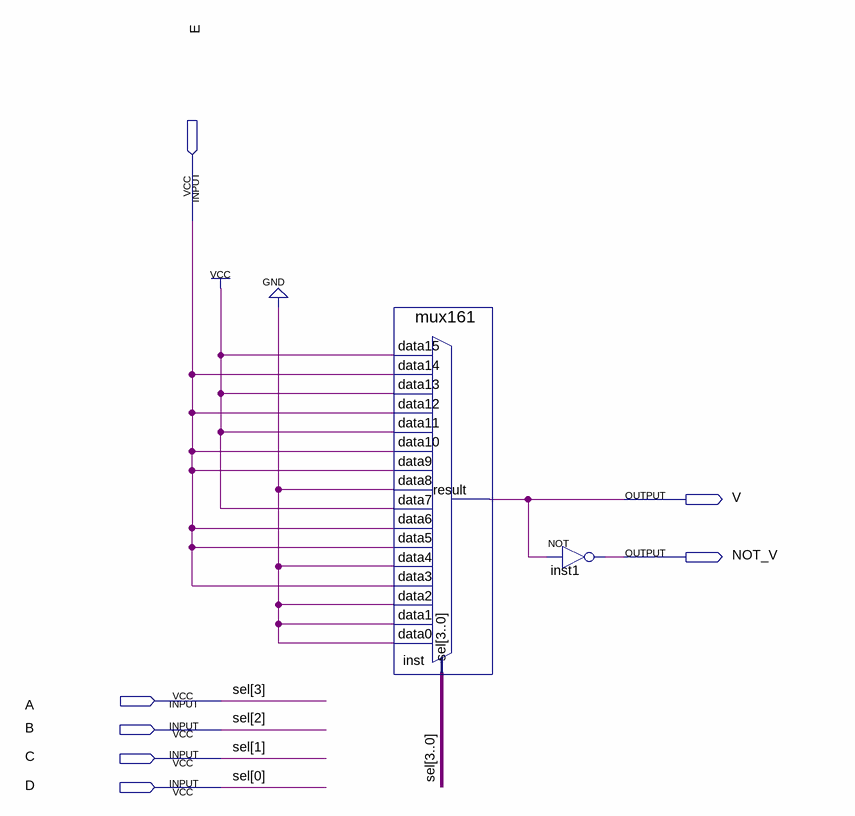
[diagram p0: schematic sheet]
// Quartus schematic devoir1_c2.bdf as structural Verilog: 2 symbols, 7 pins
module devoir1_c2 (
  input  E,
  input  A,
  input  B,
  input  C,
  input  D,
  output V,
  output NOT_V
);

  mux161 inst (
    .data15(1'b1), .data14(E), .data13(1'b1), .data12(E), .data11(1'b1), .data10(E), .data9(E), .data8(1'b0),
    .data7(1'b1), .data6(E), .data5(E), .data4(1'b0), .data3(E), .data2(1'b0), .data1(1'b0), .data0(1'b0),
    .sel({A, B, C, D}), .result(V));
  not inst1 (NOT_V, V);

  // Other names for the same wires on the sheet: sel[3:0] = {A, B, C, D}
endmodule
